# Altium schematic sheet Peripherals.SchDoc
size A4; SheetNumber: 2; SheetTotal: 3
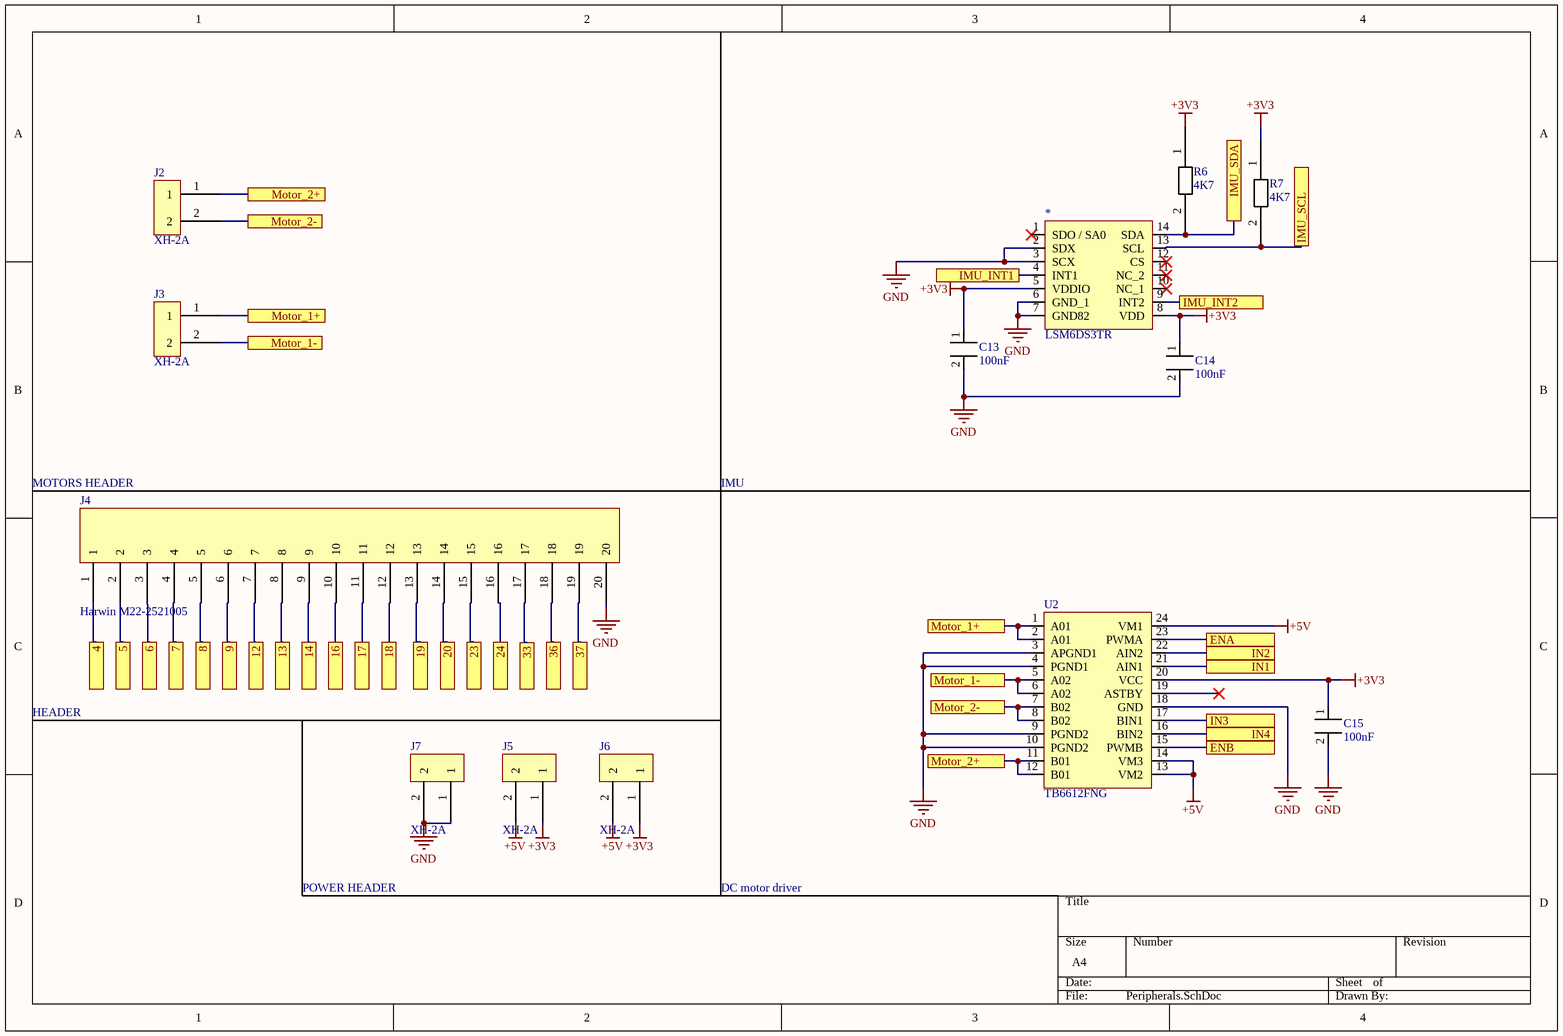
[diagram p0: Peripherals.SchDoc]

## Parts
*  LSM6DS3TR  [LSM6DS3TR]
C13  100nF  [Condo]
C14  100nF  [Condo]
C15  100nF  [Condo]
J2  XH-2A  [XH-2A]
J3  XH-2A  [XH-2A]
J4  Harwin M22-2521005  [M22-2521005]
J5  XH-2A  [XH-2A]
J6  XH-2A  [XH-2A]
J7  XH-2A  [XH-2A]
R6  4K7  [Resistor]
R7  4K7  [Resistor]
U2  TB6612FNG  [TB6612FNG]

## Ports
4 (see Controller[3A]), 5 (see Controller[3A]), 6 (see Controller[3A]), 7 (see Controller[3A]), 8 (see Controller[3A]), 9 (see Controller[3A]), 12 (see Controller[3B]), 13 (see Controller[3B]), 14 (see Controller[3B]), 16 (see Controller[4B]), 17 (see Controller[4B]), 18 (see Controller[4B]), 19 (see Controller[4B]), 20 (see Controller[5B]), 23 (see Controller[5B]), 24 (see Controller[5B]), 33 (see Controller[5A]), 36 (see Controller[6A]), 37 (see Controller[6A]), ENA (see Controller[6A]), ENB (see Controller[6A]), IMU_INT1 (see Controller[3A]), IMU_INT2 (see Controller[3A]), IMU_SCL (see Controller[5B]), IMU_SDA (see Controller[4B]), IN1 (see Controller[5A]), IN2 (see Controller[6A]), IN3 (see Controller[6A]), IN4 (see Controller[6A]), Motor_1+ (see Peripherals[1B]), Motor_1+ (see Peripherals[3C]), Motor_1- (see Peripherals[1B]), Motor_1- (see Peripherals[3C]), Motor_2+ (see Peripherals[1A]), Motor_2+ (see Peripherals[3C]), Motor_2- (see Peripherals[1A]), Motor_2- (see Peripherals[3C])

## Nets
+3V3: *.5(VDDIO) *.8(VDD) C13.1(IN) C14.1(IN) C15.1(IN) J5.1 J6.1 R6.1 R7.1 U2.20(VCC)
+5V: J5.2 J6.2 U2.13(VM2) U2.14(VM3) U2.24(VM1)
GND: *.2(SDX) *.3(SCX) *.6(GND_1) *.7(GND82) C13.2(OUT) C14.2(OUT) C15.2(OUT) J4.20 J7.1 J7.2 U2.3(APGND1) U2.4(PGND1) U2.9(PGND2) U2.10(PGND2) U2.18(GND)
4: J4.1 ; port 4
5: J4.2 ; port 5
6: J4.3 ; port 6
7: J4.4 ; port 7
8: J4.5 ; port 8
9: J4.6 ; port 9
12: J4.7 ; port 12
13: J4.8 ; port 13
14: J4.9 ; port 14
16: J4.10 ; port 16
17: J4.11 ; port 17
18: J4.12 ; port 18
19: J4.13 ; port 19
20: J4.14 ; port 20
23: J4.15 ; port 23
24: J4.16 ; port 24
33: J4.17 ; port 33
36: J4.18 ; port 36
37: J4.19 ; port 37
ENA: U2.23(PWMA) ; port ENA
ENB: U2.15(PWMB) ; port ENB
IMU_INT1: *.4(INT1) ; port IMU_INT1
IMU_INT2: *.9(INT2) ; port IMU_INT2
IMU_SCL: *.13(SCL) R7.2 ; port IMU_SCL
IMU_SDA: *.14(SDA) R6.2 ; port IMU_SDA
IN1: U2.21(AIN1) ; port IN1
IN2: U2.22(AIN2) ; port IN2
IN3: U2.17(BIN1) ; port IN3
IN4: U2.16(BIN2) ; port IN4
Motor_1+: J3.1 U2.1(A01) U2.2(A01) ; port Motor_1+
Motor_1-: J3.2 U2.5(A02) U2.6(A02) ; port Motor_1-
Motor_2+: J2.1 U2.11(B01) U2.12(B01) ; port Motor_2+
Motor_2-: J2.2 U2.7(B02) U2.8(B02) ; port Motor_2-

Not connected (* = marked no-connect by the designer): * 1(SDO_/_SA0)* 10(NC_1)* 11(NC_2)* 12(CS)*; U2 19(ASTBY)*

## Notes on the sheet
- MOTORS HEADER
- IMU
- HEADER
- POWER HEADER
- DC motor driver

## Library data of the parts
C13-C15 = CAPA
R6 R7 = Resistor